# Altium schematic sheet p8_wch_link.SchDoc
size A3; SheetNumber: 8; SheetTotal: 8
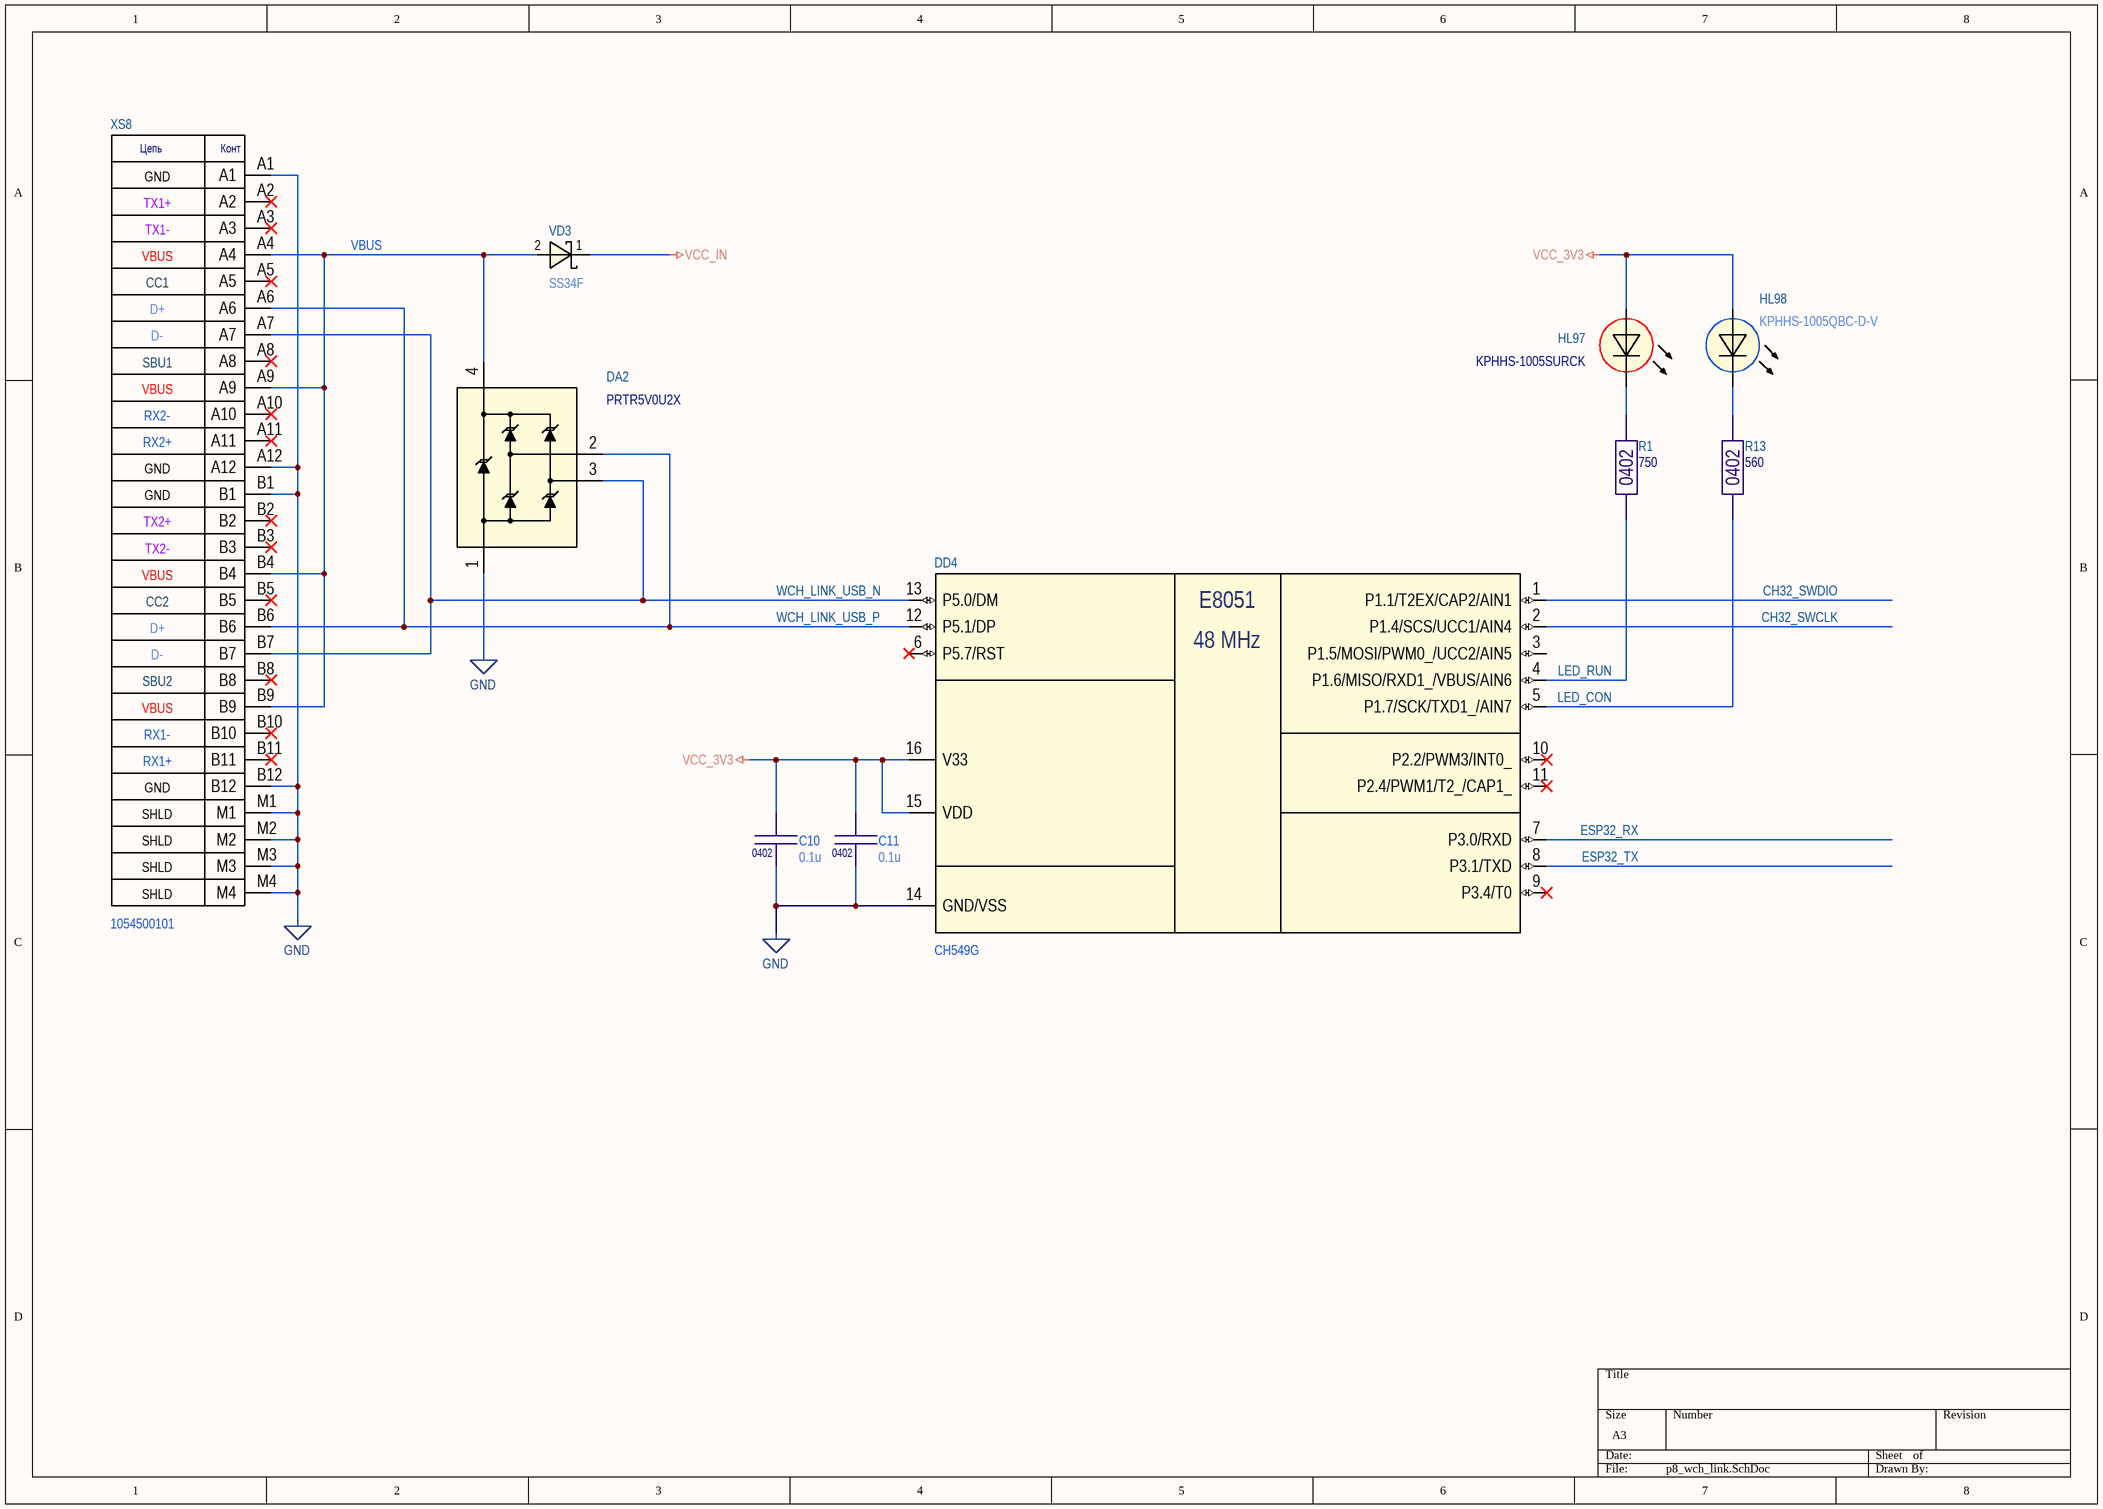
[diagram p0: p8_wch_link.SchDoc]

## Parts
C10  0.1u  Package: 0402  [CAP0402]
C11  0.1u  Package: 0402  [CAP0402]
DA2  PRTR5V0U2X  [SOT143]
DD4  CH549G  [SOIC-16]
HL97  KPHHS-1005SURCK  [LED0402R]
HL98  KPHHS-1005QBC-D-V  [LED0402B]
R1  750  Package: 0402  [RES0402B]
R13  560  Package: 0402  [RES0402B]
VD3  SS34F  [SMA-FL]
XS8  1054500101  [1054500101]

## Nets
GND: C10.2 C11.2 DA2.1(GND) DD4.14(GND/VSS) XS8.A1 XS8.A12 XS8.B1 XS8.B12 XS8.M1 XS8.M2 XS8.M3 XS8.M4
VCC_3V3: C10.1 C11.1 DD4.15(VDD) DD4.16(V33) HL97.2 HL98.2
VCC_IN: VD3.1
CH32_SWCLK: DD4.2(P1.4/SCS/UCC1/AIN4)
CH32_SWDIO: DD4.1(P1.1/T2EX/CAP2/AIN1)
ESP32_RX: DD4.7(P3.0/RXD)
ESP32_TX: DD4.8(P3.1/TXD)
LED_CON: DD4.5(P1.7/SCK/TXD1_/AIN7) R13.2
LED_RUN: DD4.4(P1.6/MISO/RXD1_/VBUS/AIN6) R1.2
VBUS: DA2.4(VCC) VD3.2 XS8.A4 XS8.A9 XS8.B4 XS8.B9
WCH_LINK_USB_N: DA2.3(IO2) DD4.13(P5.0/DM) XS8.A7 XS8.B7
WCH_LINK_USB_P: DA2.2(IO1) DD4.12(P5.1/DP) XS8.A6 XS8.B6
NetHL97_1: HL97.1 R1.1
NetHL98_1: HL98.1 R13.1

Not connected (* = marked no-connect by the designer): DD4 3(P1.5/MOSI/PWM0_/UCC2/AIN5) 6(P5.7/RST)* 9(P3.4/T0)* 10(P2.2/PWM3/INT0_)* 11(P2.4/PWM1/T2_/CAP1_)*; XS8 A2* A3* A5* A8* A10* A11* B2* B3* B5* B8* B10* B11*

## Notes on the sheet
- (in symbol 1054500101) Цепь; Конт; GND; TX1+; TX1-; VBUS; CC1; D+; D-; SBU1; RX2-; RX2+; TX2+; TX2-; CC2; SBU2; RX1-; RX1+; SHLD
- (in symbol CH549G) E8051; 48 MHz

## Library data of the parts
C10 C11 = C0402: Capacitors 0402 package case; Part Number: TCC0402X7R104J500AT; Manufacturer: CCTC; Tolerance: ± 5 %; Dielectric: X7R; Voltage: 50 V; Value: 0.1u; Value on schem: 0.1u
DA2 = PRTR5V0U2X: Ultra low capacitance double rail-to-rail ESD protection diode; Manufacturer: NXP USA Inc.; Part Number: PRTR5V0U2X; Package: SOT-143
DD4 = CH549G: 8-bit Enhanced USB MCU; Manufacturer: WinChipHead; Package: SOP16; Part Number: CH549G
HL97 = KPHHS-1005SURCK: Red led (package case 0402); Manufacturer: Kingbright Company LLC.; Designator: HL*; Forward Current: 20 mA; Forward Voltage: 1.95V; Wavelength: 630 nm; Package: 0402; Part Number: KPHHS-1005SURCK; Color: Red
HL98 = KPHHS-1005QBC-D-V: Blue led (package case 0402); Manufacturer: Kingbright Company LLC.; Designator: HL*; Forward Current: 20 mA; Forward Voltage: 3.3V; Wavelength: 465 nm; Package: 0402; Part Number: KPHHS-1005QBC-D-V; Color: Blue
R1 = R0402: Resistor 0402 package case; Part Number: RC0402FR-07750RL; Manufacturer: Yageo; Tolerance: ± 1 %; Temperature Coefficient: ±100 ppm/K; Value: 750; Value on schem: 750
R13 = R0402: Resistor 0402 package case; Part Number: RC0402FR-07560RL; Manufacturer: Yageo; Tolerance: ± 1 %; Temperature Coefficient: ±100 ppm/K; Value: 560; Value on schem: 560
VD3 = SS34F: 3A Schottky barrier rectifier; Manufacturer: UMW; Package: SMAF; Part Number: SS34F
XS8 = 1054500101: USB Shielded I/O Receptacle, Type C, Right-Angle, Top Mount, Surface Mount; Manufacturer: Molex; Part Number: 1054500101; Author: Sklyarov